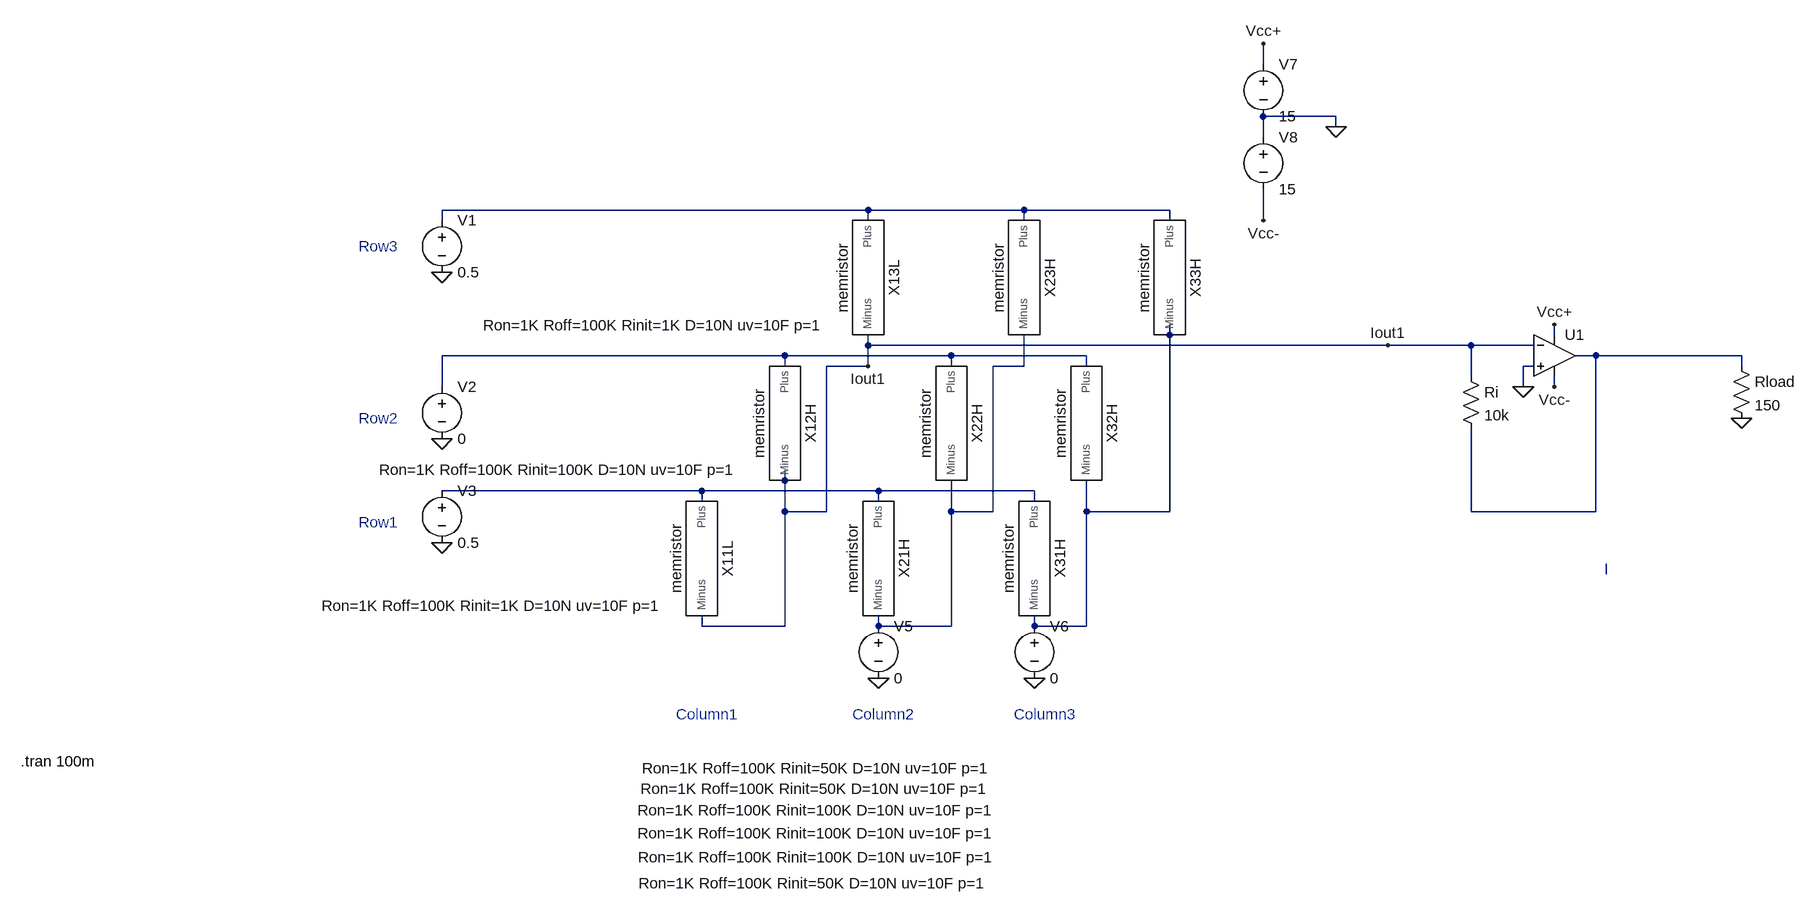
[diagram p0: schematic PassiveCrossbar.asc]
PassiveCrossbar.asc, the LTspice schematic file:
Version 4.1
SHEET 1 1304 704
WIRE 480 -576 480 -608
WIRE 592 -496 480 -496
WIRE 592 -480 592 -496
WIRE 480 -464 480 -496
WIRE -128 -352 -784 -352
WIRE 112 -352 -128 -352
WIRE 336 -352 112 -352
WIRE -784 -336 -784 -352
WIRE -128 -336 -128 -352
WIRE 112 -336 112 -352
WIRE 336 -336 336 -352
WIRE 480 -336 480 -384
WIRE 336 -160 336 -176
WIRE 928 -160 928 -176
WIRE -128 -144 -128 -160
WIRE 672 -144 -128 -144
WIRE 800 -144 672 -144
WIRE 896 -144 800 -144
WIRE -256 -128 -784 -128
WIRE 0 -128 -256 -128
WIRE 208 -128 0 -128
WIRE 992 -128 960 -128
WIRE 1216 -128 992 -128
WIRE -256 -112 -256 -128
WIRE -128 -112 -128 -144
WIRE -128 -112 -192 -112
WIRE 0 -112 0 -128
WIRE 112 -112 112 -160
WIRE 112 -112 64 -112
WIRE 208 -112 208 -128
WIRE 896 -112 880 -112
WIRE 1216 -112 1216 -128
WIRE 800 -96 800 -144
WIRE -784 -80 -784 -128
WIRE 880 -80 880 -112
WIRE 928 -80 928 -96
WIRE -256 64 -256 48
WIRE -384 80 -784 80
WIRE -112 80 -384 80
WIRE 128 80 -112 80
WIRE -384 96 -384 80
WIRE -112 96 -112 80
WIRE 128 96 128 80
WIRE -256 112 -256 64
WIRE -192 112 -192 -112
WIRE -192 112 -256 112
WIRE 0 112 0 64
WIRE 64 112 64 -112
WIRE 64 112 0 112
WIRE 208 112 208 64
WIRE 336 112 336 -160
WIRE 336 112 208 112
WIRE 800 112 800 -16
WIRE 992 112 992 -128
WIRE 992 112 800 112
WIRE 1008 208 1008 192
WIRE -384 288 -384 272
WIRE -256 288 -256 112
WIRE -256 288 -384 288
WIRE -112 288 -112 272
WIRE 0 288 0 112
WIRE 0 288 -112 288
WIRE 128 288 128 272
WIRE 208 288 208 112
WIRE 208 288 128 288
FLAG -784 -256 0
FLAG -784 0 0
FLAG -784 160 0
FLAG -112 368 0
FLAG 128 368 0
FLAG 592 -480 0
FLAG 480 -608 Vcc+
FLAG 928 -176 Vcc+
FLAG 480 -336 Vcc-
FLAG -128 -112 Iout1
FLAG 672 -144 Iout1
FLAG 928 -80 Vcc-
FLAG 880 -80 0
FLAG 1216 -32 0
SYMBOL memristor -384 176 R90
WINDOW 39 -335 73 VBottom 2
SYMATTR SpiceLine Ron=1K Roff=100K Rinit=1K D=10N uv=10F p=1
SYMATTR InstName X11L
SYMBOL voltage -784 -96 R0
WINDOW 123 0 0 Left 0
WINDOW 39 0 0 Left 0
SYMATTR InstName V2
SYMATTR Value 0
SYMBOL voltage -784 64 R0
WINDOW 123 0 0 Left 0
WINDOW 39 0 0 Left 0
SYMATTR InstName V3
SYMATTR Value 0.5
SYMBOL voltage -112 272 R0
WINDOW 123 0 0 Left 0
WINDOW 39 0 0 Left 0
SYMATTR InstName V5
SYMATTR Value 0
SYMBOL voltage 128 272 R0
WINDOW 123 0 0 Left 0
WINDOW 39 0 0 Left 0
SYMATTR InstName V6
SYMATTR Value 0
SYMBOL memristor -112 176 R90
WINDOW 39 411 94 VBottom 2
SYMATTR SpiceLine Ron=1K Roff=100K Rinit=100K D=10N uv=10F p=1
SYMATTR InstName X21H
SYMBOL memristor 128 176 R90
WINDOW 39 346 334 VBottom 2
SYMATTR SpiceLine Ron=1K Roff=100K Rinit=50K D=10N uv=10F p=1
SYMATTR InstName X31H
SYMBOL memristor 208 -32 R90
WINDOW 39 731 419 VBottom 2
SYMATTR SpiceLine Ron=1K Roff=100K Rinit=50K D=10N uv=10F p=1
SYMATTR InstName X32H
SYMBOL memristor 0 -32 R90
WINDOW 39 691 205 VBottom 2
SYMATTR SpiceLine Ron=1K Roff=100K Rinit=100K D=10N uv=10F p=1
SYMATTR InstName X22H
SYMBOL memristor -256 -32 R90
WINDOW 39 654 -50 VBottom 2
SYMATTR SpiceLine Ron=1K Roff=100K Rinit=100K D=10N uv=10F p=1
SYMATTR InstName X12H
SYMBOL memristor -128 -256 R90
WINDOW 39 528 578 VBottom 2
SYMATTR SpiceLine Ron=1K Roff=100K Rinit=1K D=10N uv=10F p=1
SYMATTR InstName X13L
SYMBOL memristor 112 -256 R90
WINDOW 39 319 716 VBottom 2
SYMATTR SpiceLine Ron=1K Roff=100K Rinit=100K D=10N uv=10F p=1
SYMATTR InstName X23H
SYMBOL memristor 336 -256 R90
WINDOW 39 810 544 VBottom 2
SYMATTR SpiceLine Ron=1K Roff=100K Rinit=50K D=10N uv=10F p=1
SYMATTR InstName X33H
SYMBOL voltage -784 -352 R0
WINDOW 123 0 0 Left 0
WINDOW 39 0 0 Left 0
SYMATTR InstName V1
SYMATTR Value 0.5
SYMBOL voltage 480 -592 R0
WINDOW 123 0 0 Left 0
WINDOW 39 0 0 Left 0
SYMATTR InstName V7
SYMATTR Value 15
SYMBOL voltage 480 -480 R0
WINDOW 123 0 0 Left 0
WINDOW 39 0 0 Left 0
SYMATTR InstName V8
SYMATTR Value 15
SYMBOL OpAmps\\UniversalOpAmp2 928 -128 R0
SYMATTR InstName U1
SYMBOL res 784 -112 R0
SYMATTR InstName Ri
SYMATTR Value 10k
SYMBOL res 1200 -128 R0
SYMATTR InstName Rload
SYMATTR Value 150
TEXT -912 128 Left 2 ;Row1
TEXT -424 424 Left 2 ;Column1
TEXT -1432 496 Left 2 !.tran 100m
TEXT -912 -32 Left 2 ;Row2
TEXT -912 -296 Left 2 ;Row3
TEXT -152 424 Left 2 ;Column2
TEXT 96 424 Left 2 ;Column3

The netlist it stands for:
* PassiveCrossbar.asc
X§X11L N006 Iout1 memristor Ron=1K Roff=100K Rinit=1K D=10N uv=10F p=1  ; pins Plus Minus
V2 N003 0 0
V3 N006 0 0.5
V5 N005 0 0
V6 N002 0 0
X§X21H N006 N005 memristor Ron=1K Roff=100K Rinit=100K D=10N uv=10F p=1  ; pins Plus Minus
X§X31H N006 N002 memristor Ron=1K Roff=100K Rinit=50K D=10N uv=10F p=1  ; pins Plus Minus
X§X32H N003 N002 memristor Ron=1K Roff=100K Rinit=50K D=10N uv=10F p=1  ; pins Plus Minus
X§X22H N003 N005 memristor Ron=1K Roff=100K Rinit=100K D=10N uv=10F p=1  ; pins Plus Minus
X§X12H N003 Iout1 memristor Ron=1K Roff=100K Rinit=100K D=10N uv=10F p=1  ; pins Plus Minus
X§X13L N001 Iout1 memristor Ron=1K Roff=100K Rinit=1K D=10N uv=10F p=1  ; pins Plus Minus
X§X23H N001 N005 memristor Ron=1K Roff=100K Rinit=100K D=10N uv=10F p=1  ; pins Plus Minus
X§X33H N001 N002 memristor Ron=1K Roff=100K Rinit=50K D=10N uv=10F p=1  ; pins Plus Minus
V1 N001 0 0.5
V7 Vcc+ 0 15
V8 0 Vcc- 15
X§U1 0 Iout1 Vcc+ Vcc- N004 level2 Avol=1Meg GBW=10Meg Slew=10Meg Ilimit=25m Rail=0 Vos=0 En=0 Enk=0 In=0 Ink=0 Rin=500Meg  ; pins In+ In- V+ V- OUT
Ri Iout1 N004 10k
Rload N004 0 150
* Row1
* Column1
.tran 100m
* Row2
* Row3
* Column2
* Column3
.lib C:\Users\daris\Documents\LTspice\memristor.sub
.lib UniversalOpAmp2.lib
.backanno
.end